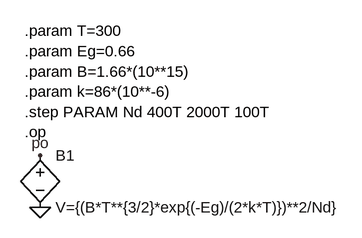
[diagram p0: schematic P12b1.asc]
P12b1.asc, the LTspice schematic file:
Version 4
SHEET 1 880 680
FLAG -368 320 0
FLAG -368 240 po
SYMBOL bv -368 224 R0
SYMATTR InstName B1
SYMATTR Value V={(B*T**{3/2}*exp{(-Eg)/(2*k*T)})**2/Nd}
TEXT -392 48 Left 2 !.param T=300\n.param Eg=0.66\n.param B=1.66*(10**15)\n.param k=86*(10**-6)\n.step PARAM Nd 400T 2000T 100T\n.op

The netlist it stands for:
* P12b1.asc
B1 po 0 V={(B*T**{3/2}*exp{(-Eg)/(2*k*T)})**2/Nd}
.param T=300
.param Eg=0.66
.param B=1.66*(10**15)
.param k=86*(10**-6)
.step PARAM Nd 400T 2000T 100T
.op
.backanno
.end